# Altium schematic sheet 原理图.SchDoc
size A4
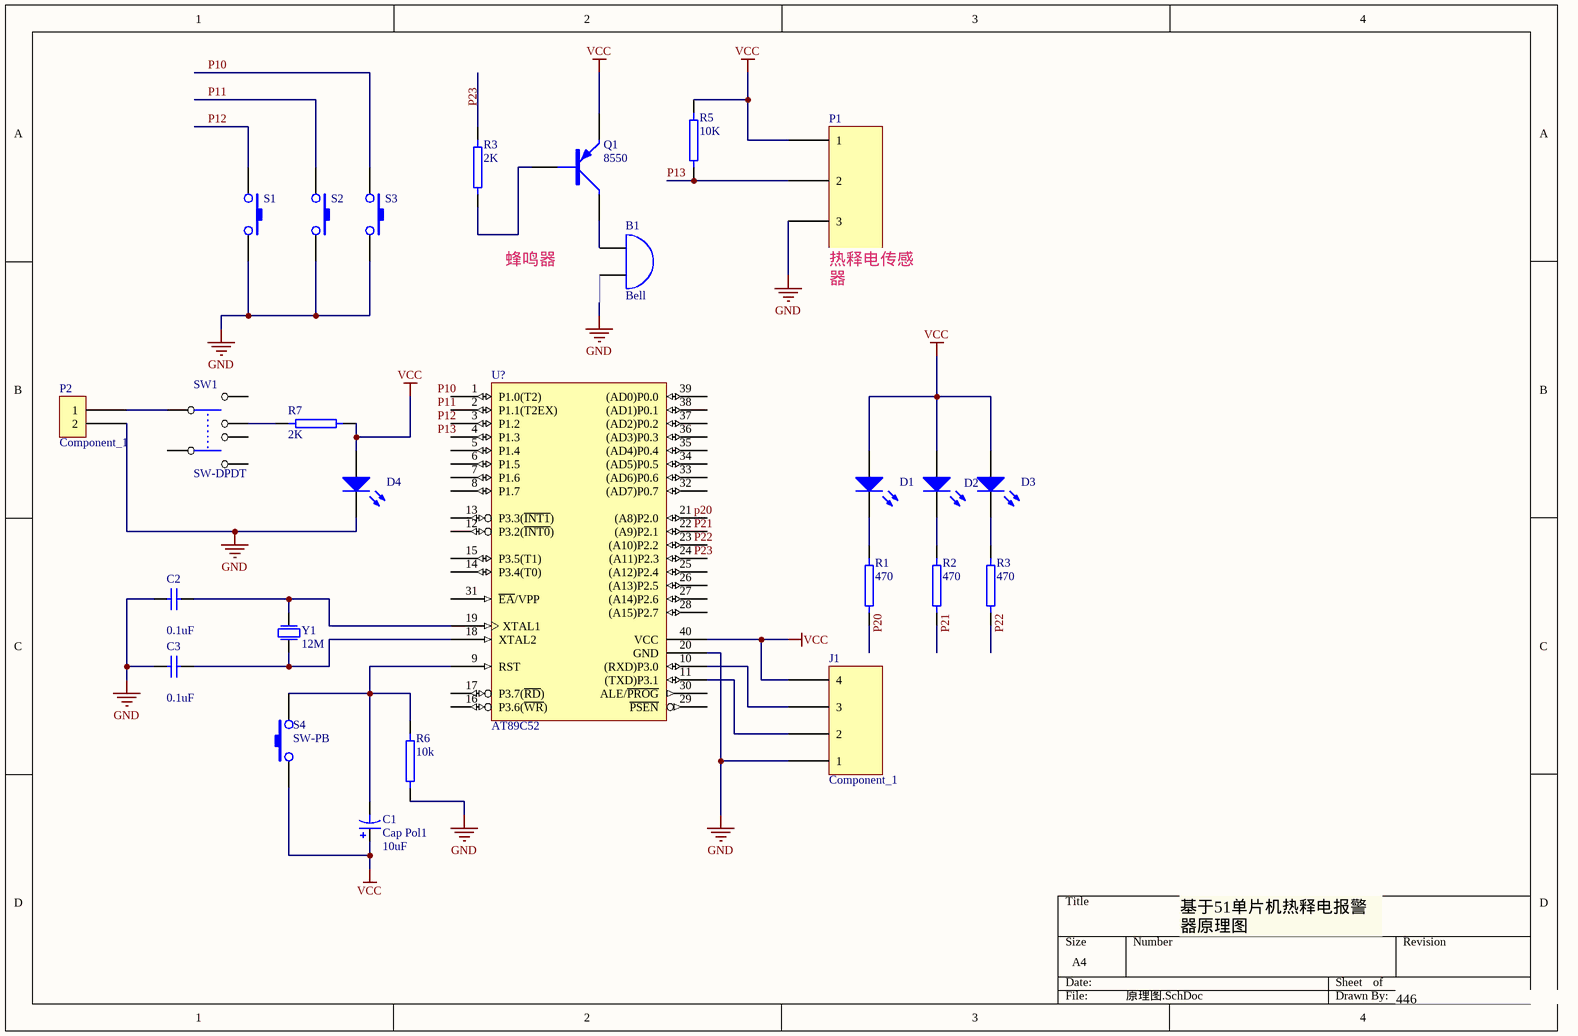
[diagram p0: 原理图.SchDoc]

## Parts
(Parts that share a designator on the sheet are numbered #1, #2 ... from top to bottom, then left to right.)
B1  Bell  [PIN2]
C1  Cap Pol1  value 10uF  [RB7.6-15]
C2  value 0.1uF  [RAD-0.3]  (hidden comment: Cap)
C3  value 0.1uF  [RAD-0.3]  (hidden comment: Cap)
D1  LED0  [LED-0]  (value not drawn)
D2  LED0  [LED-0]  (value not drawn)
D3  LED0  [LED-0]  (value not drawn)
D4  LED0  [LED-0]  (value not drawn)
J1  Component_1
P1  Component_1  [Model Name]  (value not drawn)
P2  Component_1
Q1  8550  [TO92A]
R1  470  [AXIAL0.4]
R2  470  [AXIAL0.4]
R3#1  2K  [AXIAL0.4]
R3#2  470  [AXIAL0.4]
R5  10K  [AXIAL0.4]
R6  10k  [AXIAL0.4]
R7  2K  [AXIAL0.4]
S1  SW-PB  (value not drawn)
S2  SW-PB  (value not drawn)
S3  SW-PB  (value not drawn)
S4  SW-PB
SW1  SW-DPDT
U?  AT89C52  [DIP-40]
Y1  12M  [XTAL-1]

## Nets
GND: B1.2(B) C2.1 C3.1 D4.2(K) J1.7(1) P1.2(3) P2.9(2) R6.1 S1.2 S2.2 S3.2 U?.20(GND)
VCC: C1.1 D1.1(A) D2.1(A) D3.1(A) D4.1(A) J1.6(4) P1.2(1) Q1.1(E) R5.2 R7.1 S4.1 U?.40(VCC)
P10: S3.1
P11: S2.1
P12: S1.1
P13: P1.1(2) R5.1
NetB1_1: B1.1(A) Q1.2(C)
NetC1_2: C1.2 R6.2 S4.2 U?.9(RST)
NetC2_2: C2.2 U?.19(XTAL1) Y1.1(P1)
NetC3_2: C3.2 U?.18(XTAL2) Y1.2(P2)
NetD1_2: D1.2(K) R1.2
NetD2_2: D2.2(K) R2.2
NetD3_2: D3.2(K) R3#2.2
NetJ1_4: J1.4(2) U?.11((TXD)P3.1)
NetJ1_5: J1.5(3) U?.10((RXD)P3.0)
NetP2_8: P2.8(1) SW1.1
NetQ1_3: Q1.3(B) R3#1.1
NetR7_2: R7.2 SW1.3

Not connected (* = marked no-connect by the designer): R1 1; R2 1; R3#1 2; R3#2 1; SW1 2 4 5 6; U? 1(P1.0(T2)) 2(P1.1(T2EX)) 3(P1.2) 4(P1.3) 5(P1.4) 6(P1.5) 7(P1.6) 8(P1.7) 12(P3.2(~{INT0})) 13(P3.3(~{INT1})) 14(P3.4(T0)) 15(P3.5(T1)) 16(P3.6(~{WR})) 17(P3.7(~{RD})) 21((A8)P2.0) 22((A9)P2.1) 23((A10)P2.2) 24((A11)P2.3) 25((A12)P2.4) 26((A13)P2.5) 27((A14)P2.6) 28((A15)P2.7) 29(~{PSEN}) 30(ALE/~{PROG}) 31(~{EA}/VPP) 32((AD7)P0.7) 33((AD6)P0.6) 34((AD5)P0.5) 35((AD4)P0.4) 36((AD3)P0.3) 37((AD2)P0.2) 38((AD1)P0.1) 39((AD0)P0.0)

## Notes on the sheet
- (near B1) 蜂鸣器
- (near P1) 热释电传感器
- 基于51单片机热释电报警器原理图
- 446
- Labels drawn without touching a wire or pin: P10, P11, P12, P13, P20, p20, P21, P22, P23

## Library data of the parts
B1 = Bell: Electrical Bell; Published: 24-Mar-1999; LatestRevisionDate: 17-Jul-2002; LatestRevisionNote: Re-released for DXP Platform.; PackageReference: PIN2; Publisher: Altium Limited
C1 = Cap Pol1: Polarized Capacitor (Radial); Published: 8-Jun-2000; LatestRevisionDate: 17-Jul-2002; LatestRevisionNote: Re-released for DXP Platform.; PackageReference: RB7.6-15; Publisher: Altium Limited; PackageDescription: Polarized Capacitor (Radial); 2 Leads
C2 C3 = Cap: Capacitor; Published: 8-Jun-2000; LatestRevisionDate: 17-Jul-2002; LatestRevisionNote: Re-released for DXP Platform.; PackageReference: RAD-0.3; Publisher: Altium Limited; PackageDescription: Radial Cap, Thru-Hole; 2 Leads; 0.3 in Pin Spacing
D1-D4 = LED0: Typical INFRARED GaAs LED; Published: 8-Jun-2000; LatestRevisionDate: 08-Jul-2005; LatestRevisionNote: Mech Layer 1 removed.; PackageReference: LED-0; Publisher: Altium Limited; PackageDescription: LED; 2 Leads
P1 = Component_1: J1
Q1 = PNP1E2C3B: ?
R1 R2 R3#1 R3#2 R5-R7 = RES
U? = AT89C52: 8-Bit Microcontroller with 8K Flash ROM
Y1 = CRY